# EAGLE design ES9023 (EAGLE 6.3)
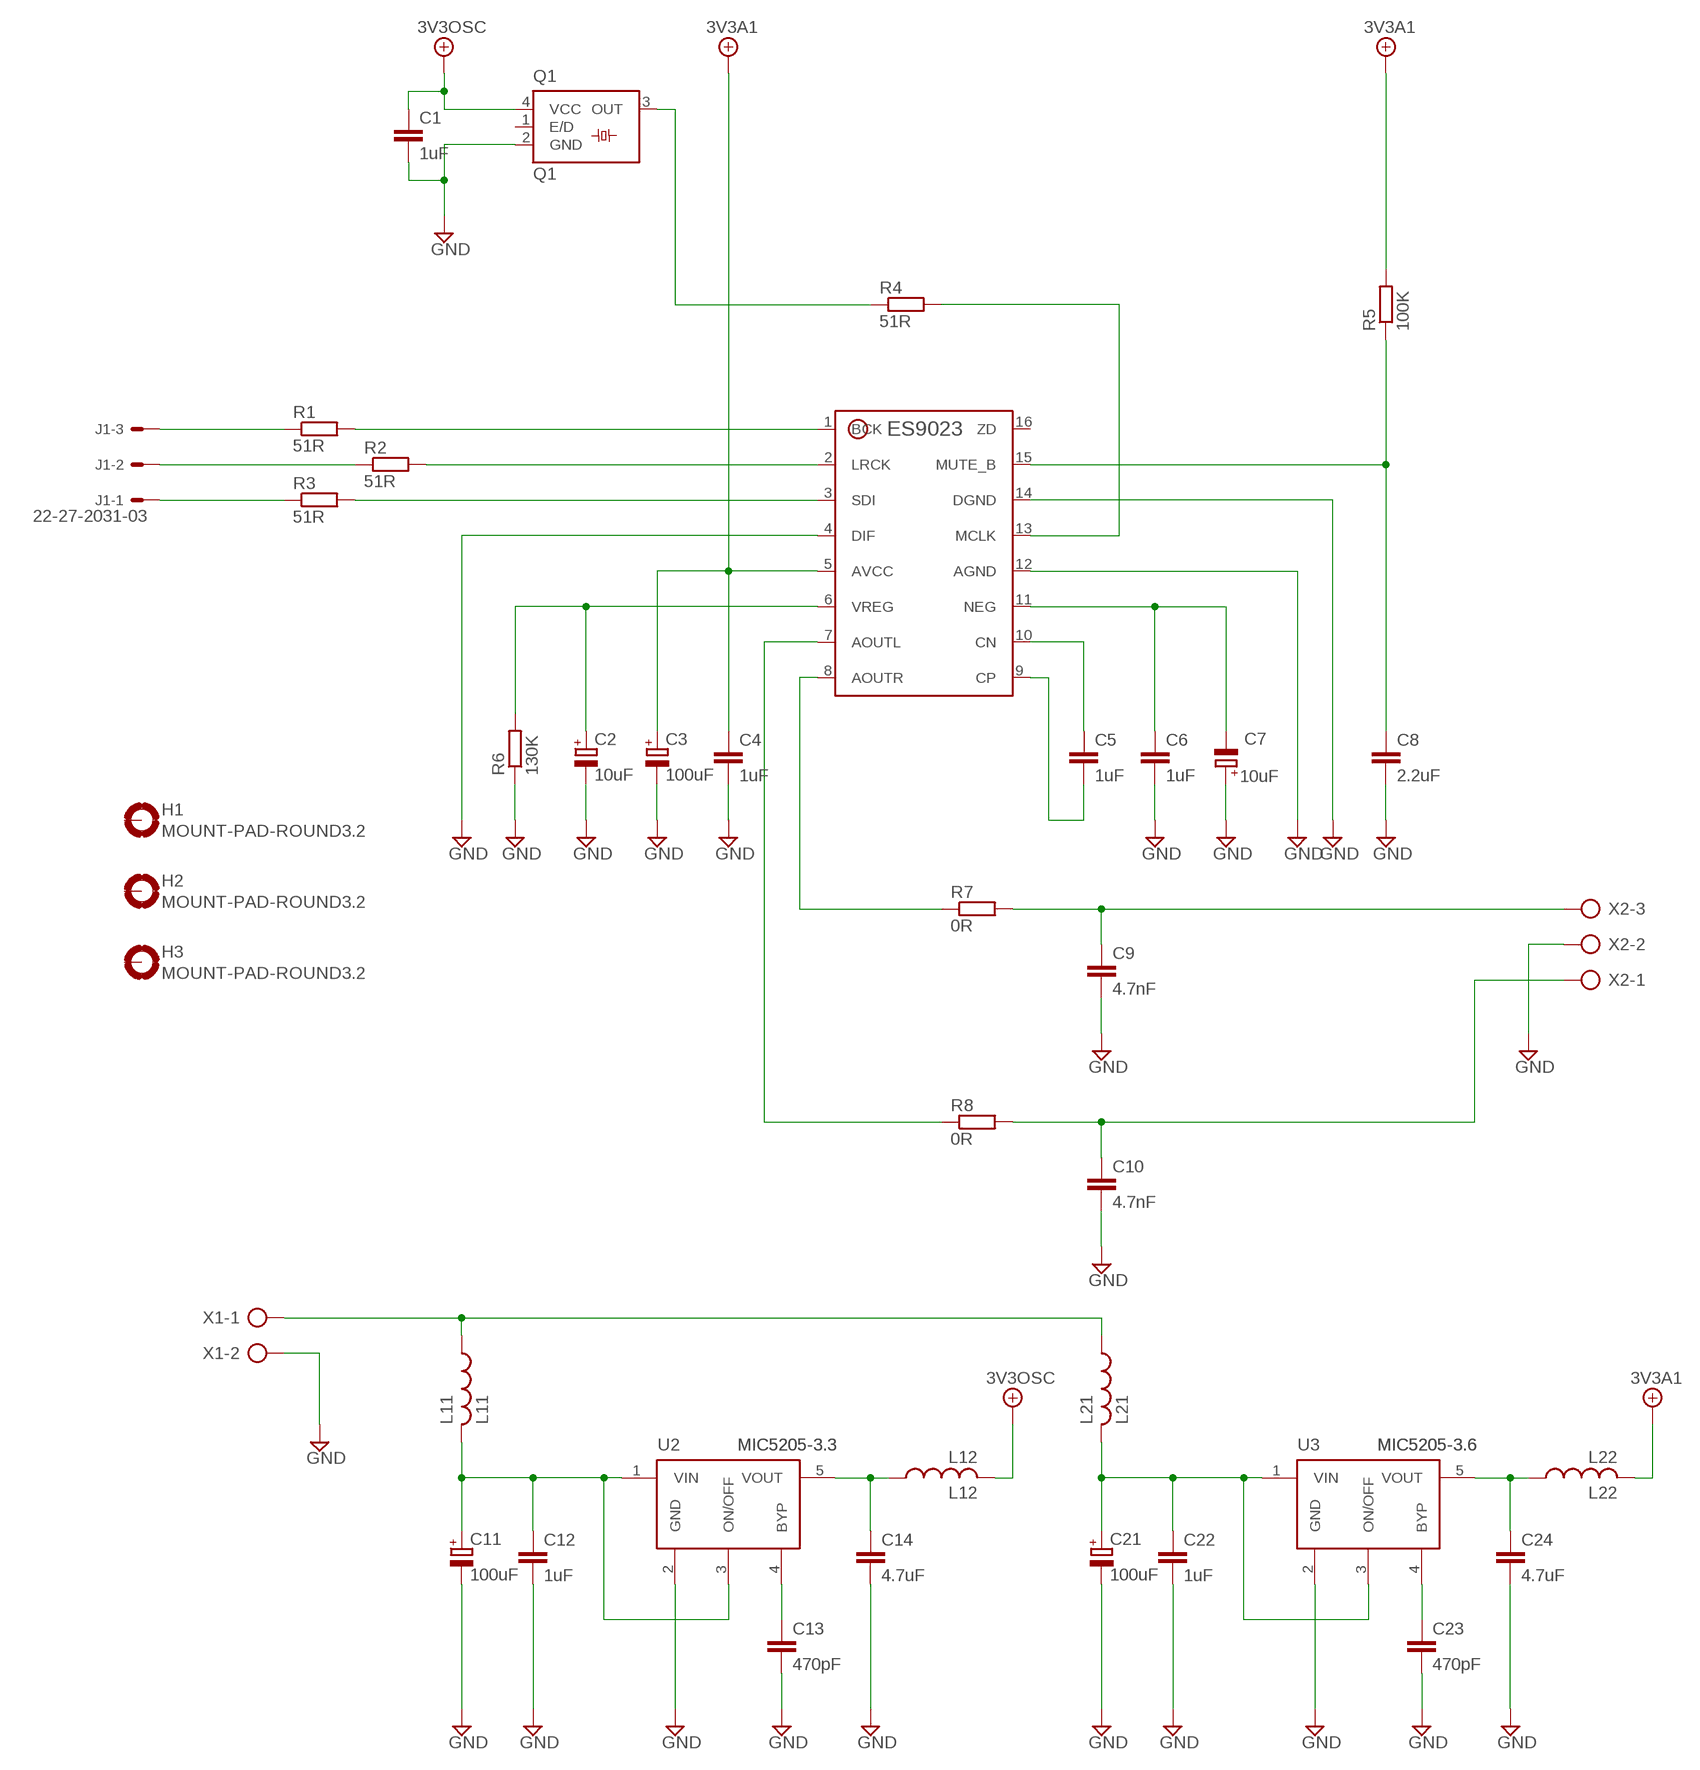
[diagram p0: schematic, sheet 1]

## Parts
C1  1uF  CAPACITORC1210  [C1210]
C2  10uF  CAP-POLE2.5-5  [E2,5-5]
C3  100uF  CAP-POLE2.5-5  [E2,5-5]
C4  1uF  CAPACITORC1210  [C1210]
C5  1uF  CAPACITORC1210  [C1210]
C6  1uF  CAPACITORC1210  [C1210]
C7  10uF  CAP-POLE2.5-5  [E2,5-5]
C8  2.2uF  CAPACITORC0805  [C0805]
C9  4.7nF  CAPACITOR5.08MM  [5.08MM]
C10  4.7nF  CAPACITOR5.08MM  [5.08MM]
C11  100uF  CAP-POLE2.5-5  [E2,5-5]
C12  1uF  CAPACITORC1210  [C1210]
C13  470pF  CAPACITORC0805  [C0805]
C14  4.7uF  CAPACITORC1210  [C1210]
C21  100uF  CAP-POLE2.5-5  [E2,5-5]
C22  1uF  CAPACITORC1210  [C1210]
C23  470pF  CAPACITORC0805  [C0805]
C24  4.7uF  CAPACITORC1210  [C1210]
H1  MOUNT-PAD-ROUND3.2  [3,2-PAD]
H2  MOUNT-PAD-ROUND3.2  [3,2-PAD]
H3  MOUNT-PAD-ROUND3.2  [3,2-PAD]
J1  22-27-2031-03  [6410-03]
L11  L11  INDUCTOR1812  [1812]
L12  L12  INDUCTORR1206  [R1206]
L21  L21  INDUCTOR1812  [1812]
L22  L22  INDUCTORR1206  [R1206]
Q1  Q1  OSCILLATOR50MHZ  [SM77H]
R1  51R  RESISTORR0805  [R0805]
R2  51R  RESISTORR0805  [R0805]
R3  51R  RESISTORR0805  [R0805]
R4  51R  RESISTORR0805  [R0805]
R5  100K  RESISTORR0805  [R0805]
R6  130K  RESISTORR0805  [R0805]
R7  0R  RESISTORR0805  [R0805]
R8  0R  RESISTORR0805  [R0805]
U1  ES9023  [SOP-16]
U2  MIC5205-3.3  MIC5205  [SOT23-5]
U3  MIC5205-3.6  MIC5205  [SOT23-5]
X1  AK300/2  [AK300/2]
X2  AK300/3  [AK300/3]

## Nets
+3.3V: C1.1 L12.2 Q1.4(VCC) ; supply symbol labelled 3V3OSC
+5V/1: C3.+ C4.1 L22.2 R5.2 U1.5(AVCC) ; supply symbol labelled 3V3A1
GND: C1.2 C2.- C3.- C4.2 C6.2 C7.+ C8.2 C9.2 C10.2 C11.- C12.2 C13.2 C14.2 C21.- C22.2 C23.2 C24.2 Q1.2(GND) R6.1 U1.4(DIF) U1.12(AGND) U1.14(DGND) U2.2(GND) U3.2(GND) X1.2 X2.2
N$1: J1.3 R1.1
N$2: J1.2 R2.1
N$3: J1.1 R3.1
N$4: R1.2 U1.1(BCK)
N$5: R2.2 U1.2(LRCK)
N$6: R3.2 U1.3(SDI)
N$7: L11.1 L21.1 X1.1
N$8: C10.1 R8.2 X2.1
N$9: C2.+ R6.2 U1.6(VREG)
N$10: R8.1 U1.7(AOUTL)
N$11: R7.1 U1.8(AOUTR)
N$12: C11.+ C12.1 L11.2 U2.1(VIN) U2.3(ON/OFF)
N$14: C13.1 U2.4(BYP)
N$15: Q1.3(OUT) R4.1
N$16: R4.2 U1.13(MCLK)
N$17: C8.1 R5.1 U1.15(MUTE_B)
N$18: C14.1 L12.1 U2.5(VOUT)
N$19: C6.1 C7.- U1.11(NEG)
N$20: C5.1 U1.10(CN)
N$21: C5.2 U1.9(CP)
N$22: C9.1 R7.2 X2.3
N$24: C21.+ C22.1 L21.2 U3.1(VIN) U3.3(ON/OFF)
N$26: C23.1 U3.4(BYP)
N$27: C24.1 L22.1 U3.5(VOUT)
Unconnected: H1.B3,2(MOUNT) H2.B3,2(MOUNT) H3.B3,2(MOUNT) Q1.1(E/D) U1.16(ZD)

## Library data of the parts
C1 C4-C6 C8-C10 C12-C14 C22-C24 = USB_ES9023 DAC:CAPACITOR
C2 C3 C7 C11 C21 = USB_ES9023 DAC:CAP-POL
H1-H3 = holes:MOUNT-PAD-ROUND: MOUNTING PAD, round
J1 = con-molex:22-?-03: CONNECTOR wire to board 2.54 mm (.1 inch) pitch header; OC_FARNELL: unknown; OC_NEWARK: unknown
L11 L12 L21 L22 = USB_ES9023 DAC:INDUCTOR
Q1 = USB_ES9023 DAC:OSCILLATOR
R1-R8 = USB_ES9023 DAC:RESISTOR
U1 = USB_ES9023 DAC:ES9023
U2 U3 = USB_ES9023 DAC:MIC5205
X1 = con-ptr500:AK300/2: CONNECTOR; OC_FARNELL: unknown; OC_NEWARK: unknown
X2 = con-ptr500:AK300/3: CONNECTOR; OC_FARNELL: unknown; OC_NEWARK: unknown

## Board
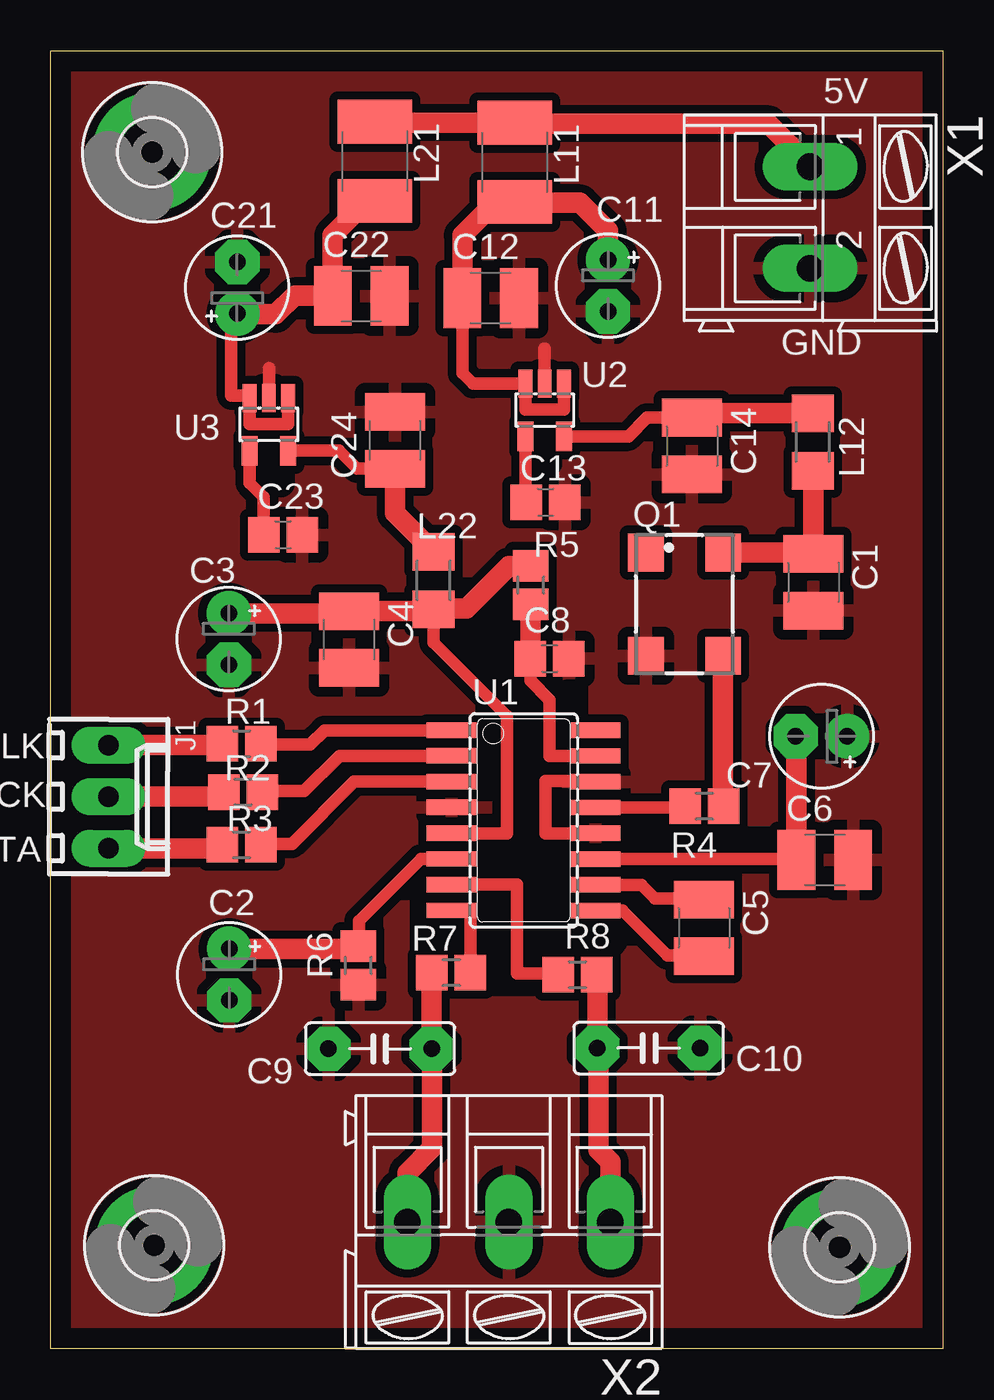
[diagram p1: board, top side]

Size 44 x 64 mm. Coordinates in mm from the lower left corner, seen from the top.
Outline: 0,0 0,64 44,64 44,0 0,0
Copper layers (1*16): Top 0.035mm / dielectric 1.5mm / Bottom 0.035mm
Design rules "ES9023 *": minimum track width 10mil, minimum drill 24mil, track to track 8mil, track to pad 8mil, pad to pad 8mil, via to via 8mil, smd to smd 8mil, copper to edge 40mil, drill to drill 8mil, minimum pad ring 10mil, minimum via ring 8mil, stop-mask expansion 4mil, vias tented up to drill 0mil, thermal gap 20mil
tRestrict: area 28.6,25.3 to 29.8,25.5; area 11.3,42.5 to 11.5,42.8; area 24.5,43.5 to 24.7,43.7; area 34.6,25.2 to 35,25.3; area 21,18 to 23.9,18.2; area 18.3,19.8 to 19.8,22.2; area 21.8,23.9 to 22.6,24.2; area 23.4,29 to 24,29.3; area 23.9,20 to 24.6,28.1; area 25.7,19.9 to 28,20.5; area 26.4,27.5 to 26.6,28.5; area 27.4,29.2 to 27.8,30.6; 1 more areas

### Footprints (pad centres in the part's own frame; a part is rotated, then mirrored left to right if it is on the bottom)
C1210 = smd 1.854 x 2.954: 1 -1.4,0; 2 1.4,0
E2,5-5 = drill 0.813 pad 2.184: + -1.27,0 | drill 0.813 pad 2.184 octagon: - 1.27,0
C0805 = smd 1.554 x 1.754: 1 -0.95,0; 2 0.95,0
5.08MM = drill 0.813 pad 2.184 octagon: 1 -2.54,0; 2 2.54,0
3,2-PAD = drill 3.2 pad 5.842: B3,2 0,0
6410-03 = drill 1.016 long: 1 2.54,0; 2 0,0; 3 -2.54,0
1812 = smd 2.154 x 3.654: 1 -1.95,0; 2 1.95,0
R1206 = smd 1.854 x 2.057: 1 -1.422,0; 2 1.422,0
SM77H = smd 1.854 x 1.754: 1 -2.55,-1.9; 2 2.55,-1.9; 3 2.55,1.9; 4 -2.55,1.9
R0805 = smd 1.554 x 1.754: 1 -0.95,0; 2 0.95,0
SOP-16 = smd 0.754 x 2.454: 1 -3.175,-3.55; 2 -1.915,-3.55; 3 -0.645,-3.55; 4 0.625,-3.55; 5 1.905,-3.55; 6 3.165,-3.55; 7 4.435,-3.55; 8 5.705,-3.55; 9 5.715,3.55; 10 4.445,3.55; 11 3.175,3.55; 12 1.905,3.55; 13 0.635,3.55; 14 -0.635,3.55; 15 -1.905,3.55; 16 -3.175,3.55
SOT23-5 = smd 0.677 x 1.378: 1 -0.95,-1.3; 2 0,-1.3; 3 0.95,-1.3 | smd 0.804 x 1.454: 4 0.95,1.3; 5 -0.95,1.3
AK300/2 = drill 1.321 long: 1 -2.515,0; 2 2.489,0
AK300/3 = drill 1.321 long: 1 -5.004,0; 2 0,0; 3 5.004,0

### Placement (x,y rotation side)
C1  37.61,37.79 270 top
C2  8.8,18.45 270 top
C3  8.78,34.99 270 top
C4  14.71,34.97 270 top
C5  32.21,20.75 270 top
C6  38.17,24.11 0 top
C7  38.01,30.2 180 top
C8  24.6,34.03 0 top
C9  16.24,14.79 180 top
C10  29.49,14.83 0 top
C11  27.48,52.42 270 top
C12  21.69,51.81 0 top
C13  24.4,41.73 0 top
C14  31.62,44.51 270 top
C21  9.2,52.31 90 top
C22  15.31,51.91 0 top
C23  11.45,40.13 0 top
C24  16.99,44.79 90 top
H1  5.1,5.1 0 top
H2  38.9,5 0 top
H3  5,59 0 top
J1  2.85,27.22 270 top
L11  22.88,58.5 270 top
L12  37.58,44.7 270 top
L21  15.98,58.55 270 top
L22  18.88,37.88 270 top
Q1  31.25,36.71 270 top
R1  9.42,29.83 0 top
R2  9.49,27.45 0 top
R3  9.41,24.85 0 top
R4  32.23,26.75 180 top
R5  23.67,37.65 90 top
R6  15.17,18.9 90 top
R7  19.75,18.55 180 top
R8  25.97,18.45 0 top
U1  23.32,27.32 270 top
U2  24.36,46.28 180 top
U3  10.76,45.58 180 top
X1  37.45,55.76 270 top
X2  22.59,6.25 180 top

### Tracks (layer width: path | path; a pad name or v marks a point on that pad's centre or on a via)
+3.3V
  Top 1.016: Q1.4 37.54,39.26 C1.1 37.61,43.25 L12.2
+5V/1
  Top 0.406: U1.5
  Top 0.61: U1.5 22.5,25.41 22.5,31.2 18.88,34.82 L22.2
  Top 1.016: 9,36.3 9,36.4 8.78,36.4 C3.+ 14.71,36.26 C4.1 18.88,36.37 L22.2 18.92,36.5 20.5,36.5 22.6,38.6 R5.2
GND
  Top 0.406: 24.36,49.3 24.4,49.3 | 10.76,48.36 10.8,48.4 | U1.14 26.87,28
  Top 0.61: U2.2 24.36,49.3 | U3.2 10.76,48.36 | 26.87,28 24.4,28 24.4,25.41 U1.12
  pour Top (isolate 0.406): 0,64 44,64 44,0 0,0
N$1
  Top 1.016: J1.3 8.4,29.76 R1.1
N$2
  Top 1.016: J1.2 8.31,27.22 R2.1
N$3
  Top 1.016: J1.1 8.29,24.68 R3.1
N$4
  Top 0.406: 10.4,29.8 R1.2
  Top 0.61: U1.1 13.49,30.5 12.8,29.8 10.4,29.8
N$5
  Top 0.406: 10.49,27.5 R2.2
  Top 0.61: U1.2 14.23,29.23 12.5,27.5 10.49,27.5
N$6
  Top 0.406: 10.41,24.9 R3.2
  Top 0.61: U1.3 14.96,27.96 11.9,24.9 10.41,24.9
N$7
  Top 1.016: X1.1 37.45,58.35 35.4,60.4 22.93,60.4 L11.1 16.03,60.45 L21.1
N$8
  Top 1.016: X2.1 27.59,9.21 27,9.8 27,14.78 C10.1 26.95,18.42 R8.2
N$9
  Top 0.406: 15.2,19.88 R6.2
  Top 0.61: U1.6 18.25,24.16 15.2,21.1 15.2,19.88
  Top 1.016: C2.+ 15.04,19.72 R6.2
N$10
  Top 0.406: 25.02,18.4 R8.1 25.02,18.5
  Top 0.61: U1.7 23,22.89 23,18.5 25.02,18.5
N$11
  Top 0.406: 20.7,21.6 19.77,21.6 U1.8
  Top 0.61: R7.1 20.7,21.6
N$12
  Top 0.406: C12.1 | U2.3
  Top 0.61: C12.1 20.3,48.1 20.82,47.58 U2.3 | U2.1 25.31,46.3 23.4,46.3 U2.3
  Top 1.016: C11.+ 27.48,55.12 26.1,56.5 22.93,56.5 L11.2 21.95,56.55 20.3,54.9 C12.1
N$14
  Top 0.406: 23.41,41.77 C13.1
  Top 0.61: U2.4 23.41,41.77
N$15
  Top 1.016: Q1.3 33.15,26.78 R4.1
N$16
  Top 0.406: 31.22,26.68 R4.2
  Top 0.61: U1.13 31.22,26.68
N$17
  Top 0.61: C8.1 23.65,32.95 24.6,32 24.6,29.23 U1.15
  Top 1.016: R5.1 23.67,34.05 C8.1
N$18
  Top 0.406: C14.1
  Top 0.61: U2.5 28.48,44.98 29.4,45.9 C14.1
  Top 1.016: L12.1 32.12,46.12 32,46 31.71,46 C14.1
N$19  (1 unrouted)
  Top 0.406: 36.77,24.14 C6.1
  Top 0.61: U1.11 36.77,24.14
  Top 1.016: 36.77,30.2 C6.1
N$20
  Top 0.406: 32.16,22.2 C5.1
  Top 0.61: U1.10 29.12,22.88 29.8,22.2 32.16,22.2
N$21
  Top 0.406: 32.16,19.4 C5.2
  Top 0.61: U1.9 28.2,21.61 30.4,19.4 32.16,19.4
N$22
  Top 1.016: X2.3 17.59,8.69 18.8,9.9 18.8,14.77 C9.1 18.78,18.53 R7.2
N$24
  Top 0.406: U3.1 | U3.3 9.81,46.9 | 9.81,46.9 9.8,46.9 | 9.81,46.9 9.81,47
  Top 0.61: U3.3 9.81,45.6 11.7,45.6 U3.1 | 9.81,47 8.9,47 8.9,50.74 C21.+
  Top 1.016: L21.2 15.6,56.6 13.9,54.9 C22.1 | C22.1 | C22.1 12.02,51.92 11.1,51 9.24,51 C21.+
N$26
  Top 0.61: U3.4 9.81,42.69 10.5,42 C23.1
N$27
  Top 0.406: C24.1
  Top 0.61: U3.5 14.22,44.28 15.1,43.4 C24.1
  Top 1.016: C24.1 16.99,41.19 L22.1

### Text on the board
tPlace: 5V | GND | BCLK | LRCK | DATA
Document: RT | LT